# EAGLE design seed-raspi (EAGLE 6.4)

## Sheet 1 of 7

## Sheet 2 of 7
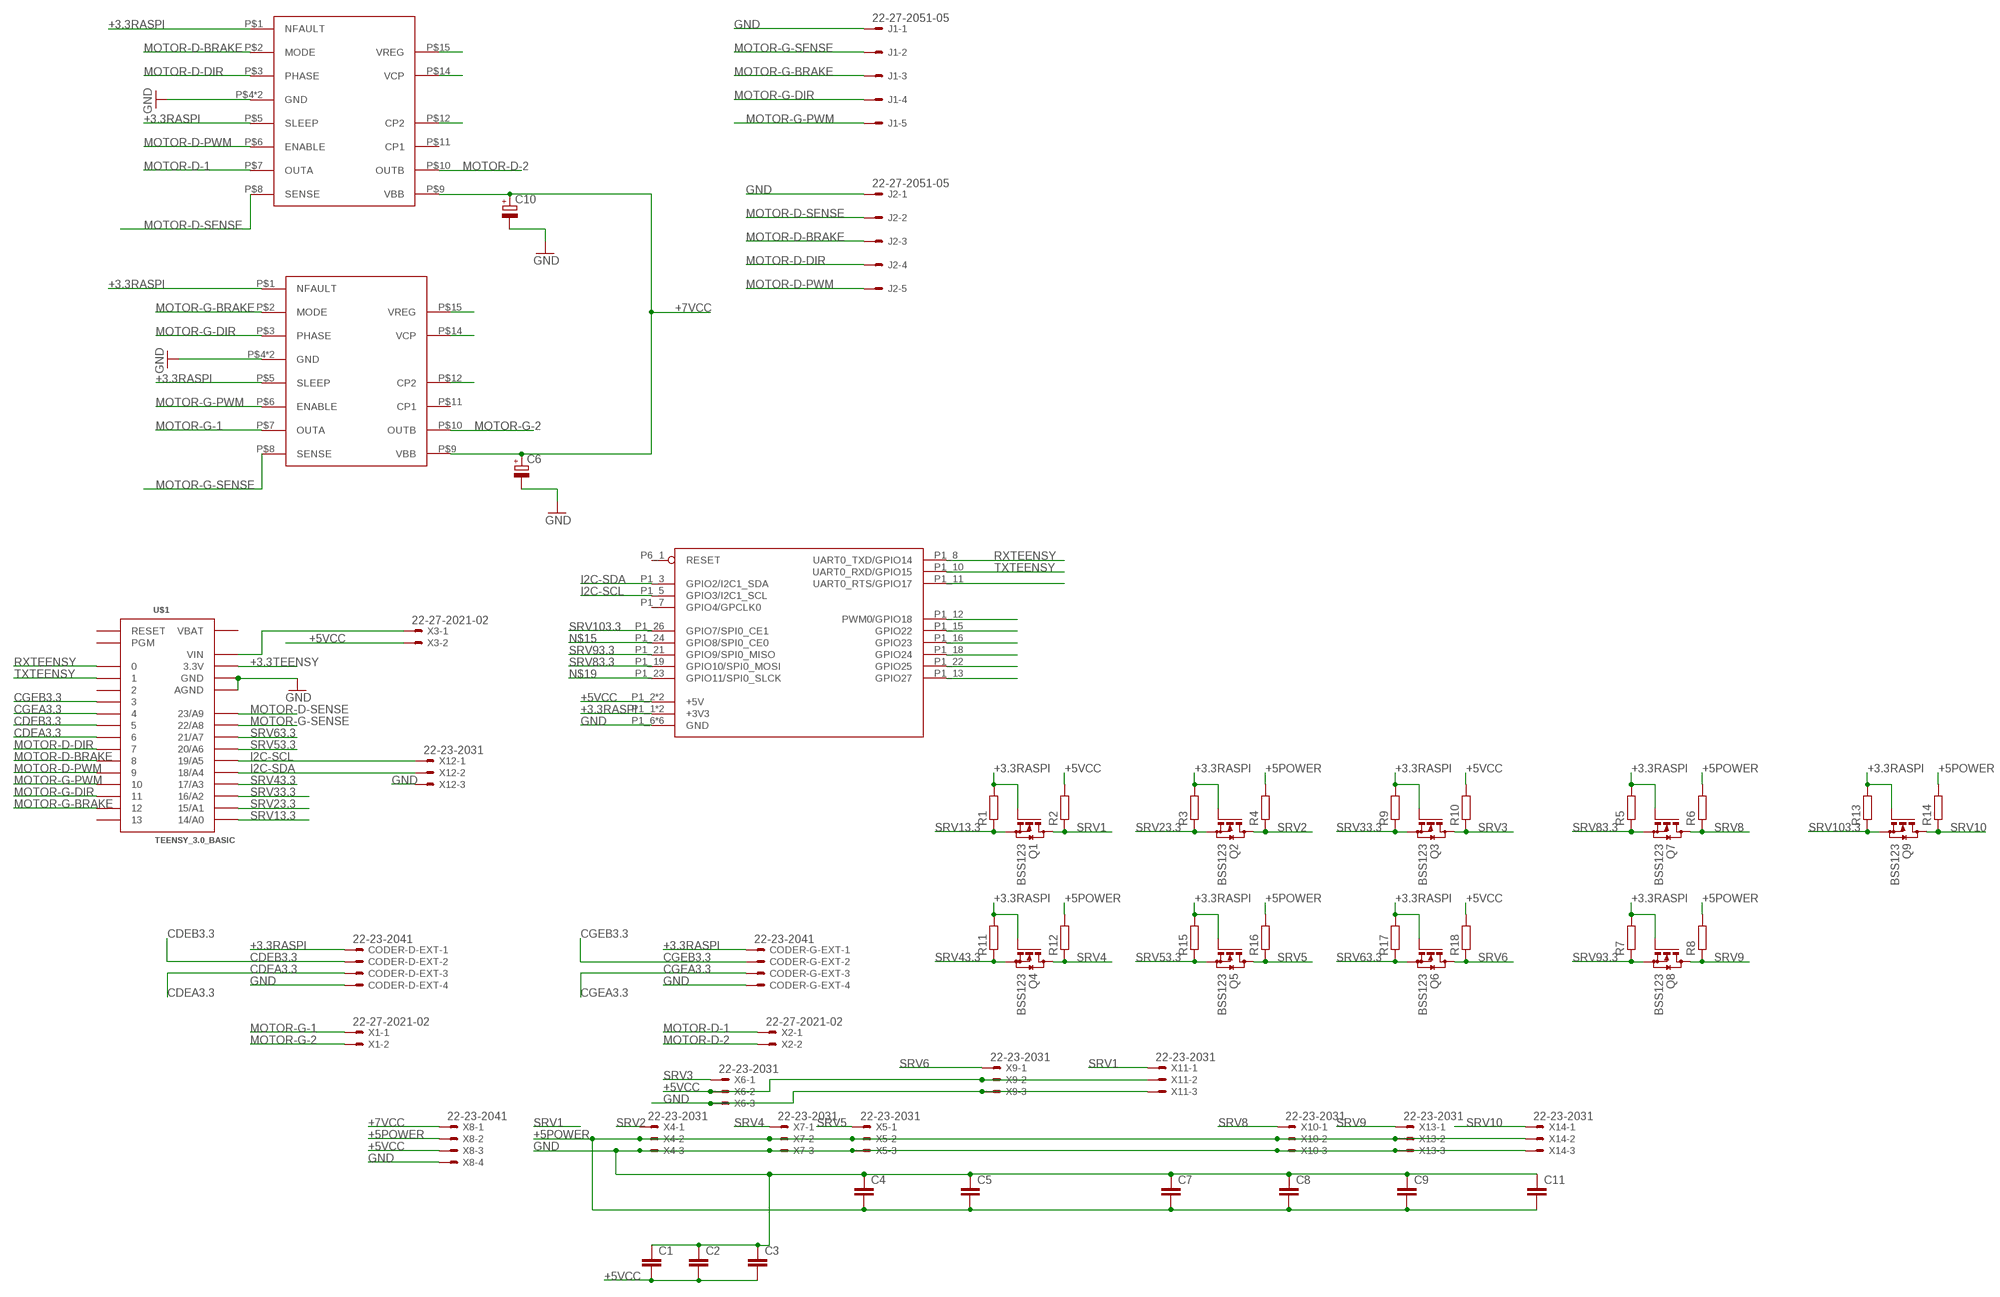
[diagram p0: schematic, sheet 2]

### Parts
C1  C-EUC0603K  [C0603K]
C2  C-EUC0603K  [C0603K]
C3  C-EUC0603K  [C0603K]
C4  C-EUC0603K  [C0603K]
C5  C-EUC0603K  [C0603K]
C6  CPOL-EUE3.5-8  [E3,5-8]
C7  C-EUC0603K  [C0603K]
C8  C-EUC0603K  [C0603K]
C9  C-EUC0603K  [C0603K]
C10  CPOL-EUE3.5-8  [E3,5-8]
C11  C-EUC0603K  [C0603K]
CODER-D-EXT  22-23-2041  [22-23-2041]
CODER-G-EXT  22-23-2041  [22-23-2041]
J1  22-27-2051-05  [6410-05]
J2  22-27-2051-05  [6410-05]
Q1  BSS123  [SOT23]
Q2  BSS123  [SOT23]
Q3  BSS123  [SOT23]
Q4  BSS123  [SOT23]
Q5  BSS123  [SOT23]
Q6  BSS123  [SOT23]
Q7  BSS123  [SOT23]
Q8  BSS123  [SOT23]
Q9  BSS123  [SOT23]
R1  R-EU_R0603  [R0603]
R2  R-EU_R0603  [R0603]
R3  R-EU_R0603  [R0603]
R4  R-EU_R0603  [R0603]
R5  R-EU_R0603  [R0603]
R6  R-EU_R0603  [R0603]
R7  R-EU_R0603  [R0603]
R8  R-EU_R0603  [R0603]
R9  R-EU_R0603  [R0603]
R10  R-EU_R0603  [R0603]
R11  R-EU_R0603  [R0603]
R12  R-EU_R0603  [R0603]
R13  R-EU_R0603  [R0603]
R14  R-EU_R0603  [R0603]
R15  R-EU_R0603  [R0603]
R16  R-EU_R0603  [R0603]
R17  R-EU_R0603  [R0603]
R18  R-EU_R0603  [R0603]
U$1  TEENSY_3.0_BASIC  [TEENSY_3.0_BASIC]
U$2  RPI-B-V2SHIELD  [RPI-B-V2-SHIELD]
U$3  A3950-DIL  [DIL16]
U$4  A3950-DIL  [DIL16]
X1  22-27-2021-02  [6410-02]
X2  22-27-2021-02  [6410-02]
X3  22-27-2021-02  [6410-02]
X4  22-23-2031  [22-23-2031]
X5  22-23-2031  [22-23-2031]
X6  22-23-2031  [22-23-2031]
X7  22-23-2031  [22-23-2031]
X8  22-23-2041  [22-23-2041]
X9  22-23-2031  [22-23-2031]
X10  22-23-2031  [22-23-2031]
X11  22-23-2031  [22-23-2031]
X12  22-23-2031  [22-23-2031]
X13  22-23-2031  [22-23-2031]
X14  22-23-2031  [22-23-2031]

### Nets
+3.3RASPI: CODER-D-EXT.1 CODER-G-EXT.1 Q1.1(G) Q2.1(G) Q3.1(G) Q4.1(G) Q5.1(G) Q6.1(G) Q7.1(G) Q8.1(G) Q9.1(G) R1.2 R3.2 R5.2 R7.2 R9.2 R11.2 R13.2 R15.2 R17.2 U$2.P1_1(+3V3) U$2.P1_17(+3V3) U$3.P$1(NFAULT) U$3.P$5(SLEEP) U$4.P$1(NFAULT) U$4.P$5(SLEEP)
+3.3TEENSY: U$1.3.3V U$1.3.3V1(3.3V)
+5POWER: C4.2 C5.2 C7.2 C8.2 C9.2 C11.2 R4.2 R6.2 R8.2 R12.2 R14.2 R16.2 X4.2 X5.2 X7.2 X8.2 X10.2 X13.2 X14.2
+5VCC: C1.2 C2.2 C3.2 R2.2 R10.2 R18.2 U$2.P1_2(+5V) U$2.P1_4(+5V) X3.2 X6.2 X8.3 X9.2 X11.2
+7VCC: C6.+ C10.+ U$3.P$9(VBB) U$4.P$9(VBB) X8.1
CDEA3.3: CODER-D-EXT.3 U$1.6
CDEB3.3: CODER-D-EXT.2 U$1.5
CGEA3.3: CODER-G-EXT.3 U$1.4
CGEB3.3: CODER-G-EXT.2 U$1.3
GND: C1.1 C2.1 C3.1 C4.1 C5.1 C6.- C7.1 C8.1 C9.1 C10.- C11.1 CODER-D-EXT.4 CODER-G-EXT.4 J1.1 J2.1 U$1.AGND U$1.GND U$1.GND1(GND) U$2.P1_6(GND) U$2.P1_9(GND) U$2.P1_14(GND) U$2.P1_20(GND) U$2.P1_25(GND) U$2.P6_2(GND) U$3.P$4(GND) U$3.P$13(GND) U$4.P$4(GND) U$4.P$13(GND) X4.3 X5.3 X6.3 X7.3 X8.4 X9.3 X10.3 X11.3 X12.3 X13.3 X14.3 ; also sheet 3,4,5,6,7
I2C-SCL: U$1.19/A5 U$2.P1_5(GPIO3/I2C1_SCL) X12.1
I2C-SDA: U$1.18/A4 U$2.P1_3(GPIO2/I2C1_SDA) X12.2
MOTOR-D-1: U$4.P$7(OUTA) X2.1
MOTOR-D-2: U$4.P$10(OUTB) X2.2
MOTOR-D-BRAKE: J2.3 U$1.8 U$4.P$2(MODE)
MOTOR-D-DIR: J2.4 U$1.7 U$4.P$3(PHASE)
MOTOR-D-PWM: J2.5 U$1.9 U$4.P$6(ENABLE)
MOTOR-D-SENSE: J2.2 U$1.23/A9 U$4.P$8(SENSE)
MOTOR-G-1: U$3.P$7(OUTA) X1.1
MOTOR-G-2: U$3.P$10(OUTB) X1.2
MOTOR-G-BRAKE: J1.3 U$1.12 U$3.P$2(MODE)
MOTOR-G-DIR: J1.4 U$1.11 U$3.P$3(PHASE)
MOTOR-G-PWM: J1.5 U$1.10 U$3.P$6(ENABLE)
MOTOR-G-SENSE: J1.2 U$1.22/A8 U$3.P$8(SENSE)
N$1: U$2.P1_12(PWM0/GPIO18)
N$2: U$2.P1_11(UART0_RTS/GPIO17)
N$3: U$1.VIN X3.1
N$4: U$2.P1_15(GPIO22)
N$5: U$2.P1_16(GPIO23)
N$6: U$2.P1_18(GPIO24)
N$7: U$2.P1_22(GPIO25)
N$8: U$3.P$15(VREG)
N$9: U$3.P$14(VCP)
N$10: U$3.P$12(CP2)
N$11: U$2.P1_13(GPIO27)
N$13: U$4.P$15(VREG)
N$14: U$4.P$14(VCP)
N$15: U$2.P1_24(GPIO8/SPI0_CE0)
N$16: U$4.P$12(CP2)
N$19: U$2.P1_23(GPIO11/SPI0_SLCK)
RXTEENSY: U$1.0 U$2.P1_8(UART0_TXD/GPIO14)
SRV1: Q1.3(D) R2.1 X11.1
SRV2: Q2.3(D) R4.1 X4.1
SRV3: Q3.3(D) R10.1 X6.1
SRV4: Q4.3(D) R12.1 X7.1
SRV5: Q5.3(D) R16.1 X5.1
SRV6: Q6.3(D) R18.1 X9.1
SRV8: Q7.3(D) R6.1 X10.1
SRV9: Q8.3(D) R8.1 X13.1
SRV10: Q9.3(D) R14.1 X14.1
SRV13.3: Q1.2(S) R1.1 U$1.14/A0
SRV23.3: Q2.2(S) R3.1 U$1.15/A1
SRV33.3: Q3.2(S) R9.1 U$1.16/A2
SRV43.3: Q4.2(S) R11.1 U$1.17/A3
SRV53.3: Q5.2(S) R15.1 U$1.20/A6
SRV63.3: Q6.2(S) R17.1 U$1.21/A7
SRV83.3: Q7.2(S) R5.1 U$2.P1_19(GPIO10/SPI0_MOSI)
SRV93.3: Q8.2(S) R7.1 U$2.P1_21(GPIO9/SPI0_MISO)
SRV103.3: Q9.2(S) R13.1 U$2.P1_26(GPIO7/SPI0_CE1)
TXTEENSY: U$1.1 U$2.P1_10(UART0_RXD/GPIO15)
Unconnected: U$1.2 U$1.13 U$1.PGM U$1.RESET U$2.P1_7(GPIO4/GPCLK0) U$3.P$11(CP1) U$4.P$11(CP1)

## Sheet 3 of 7
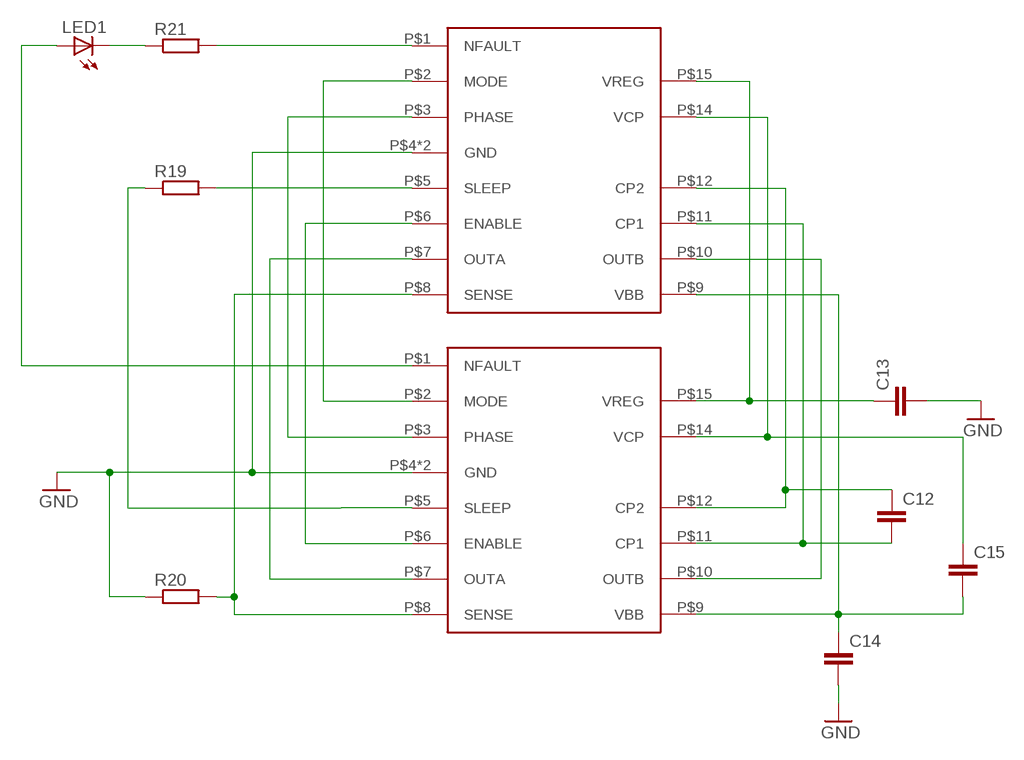
[diagram p1: schematic, sheet 3]

### Parts
C12  C-EUC0603  [C0603]
C13  C-EUC0603  [C0603]
C14  C-EUC0603  [C0603]
C15  C-EUC0603  [C0603]
LED1  LED3MM  [LED3MM]
R19  R-EU_R0603  [R0603]
R20  R-EU_R0603  [R0603]
R21  R-EU_R0603  [R0603]
U$5  A3950  [16TSSOP]
U$6  A3950-DIL  [DIL16]

### Nets
GND: C13.2 C14.2 R20.1 U$5.P$4(GND) U$5.P$13(GND) U$6.P$4(GND) U$6.P$13(GND) ; also sheet 2,4,5,6,7
N$12: R19.1 U$6.P$5(SLEEP)
N$17: LED1.A U$6.P$1(NFAULT)
N$18: U$5.P$2(MODE) U$6.P$2(MODE)
N$20: U$5.P$3(PHASE) U$6.P$3(PHASE)
N$21: U$5.P$6(ENABLE) U$6.P$6(ENABLE)
N$22: U$5.P$7(OUTA) U$6.P$7(OUTA)
N$23: R20.2 U$5.P$8(SENSE) U$6.P$8(SENSE)
N$24: C13.1 U$5.P$15(VREG) U$6.P$15(VREG)
N$25: C15.1 U$5.P$14(VCP) U$6.P$14(VCP)
N$26: C12.1 U$5.P$12(CP2) U$6.P$12(CP2)
N$27: C12.2 U$5.P$11(CP1) U$6.P$11(CP1)
N$28: U$5.P$10(OUTB) U$6.P$10(OUTB)
N$29: C14.1 C15.2 U$5.P$9(VBB) U$6.P$9(VBB)
N$30: R19.2 U$5.P$5(SLEEP)
N$31: R21.2 U$5.P$1(NFAULT)
N$32: LED1.K(C) R21.1

## Sheet 4 of 7
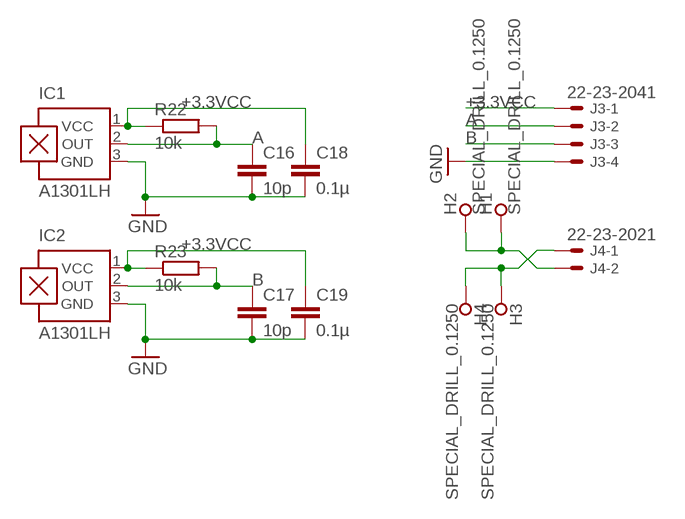
[diagram p2: schematic, sheet 4]

### Parts
C16  10p  C-EUC0805  [C0805]
C17  10p  C-EUC0805  [C0805]
C18  0.1µ  C-EUC0805  [C0805]
C19  0.1µ  C-EUC0805  [C0805]
H1  SPECIAL_DRILL_0.1250  [PAD_0.1250]
H2  SPECIAL_DRILL_0.1250  [PAD_0.1250]
H3  SPECIAL_DRILL_0.1250  [PAD_0.1250]
H4  SPECIAL_DRILL_0.1250  [PAD_0.1250]
IC1  A1301LH  [SOT23-W]
IC2  A1301LH  [SOT23-W]
J3  22-23-2041  [22-23-2041]
J4  22-23-2021  [22-23-2021]
R22  10k  R-EU_R0805  [R0805]
R23  10k  R-EU_R0805  [R0805]

### Nets
+3.3VCC: C18.1 C19.1 IC1.1(VCC) IC2.1(VCC) J3.1 R22.1 R23.1 ; also sheet 6,7
A: C16.1 IC1.2(OUT) J3.2 R22.2 ; also sheet 6,7
B: C17.1 IC2.2(OUT) J3.3 R23.2 ; also sheet 6,7
GND: C16.2 C17.2 C18.2 C19.2 IC1.3(GND) IC2.3(GND) J3.4 ; also sheet 2,3,5,6,7
N$36: H1.1 H2.1 J4.2
N$37: H3.1 H4.1 J4.1

## Sheet 5 of 7
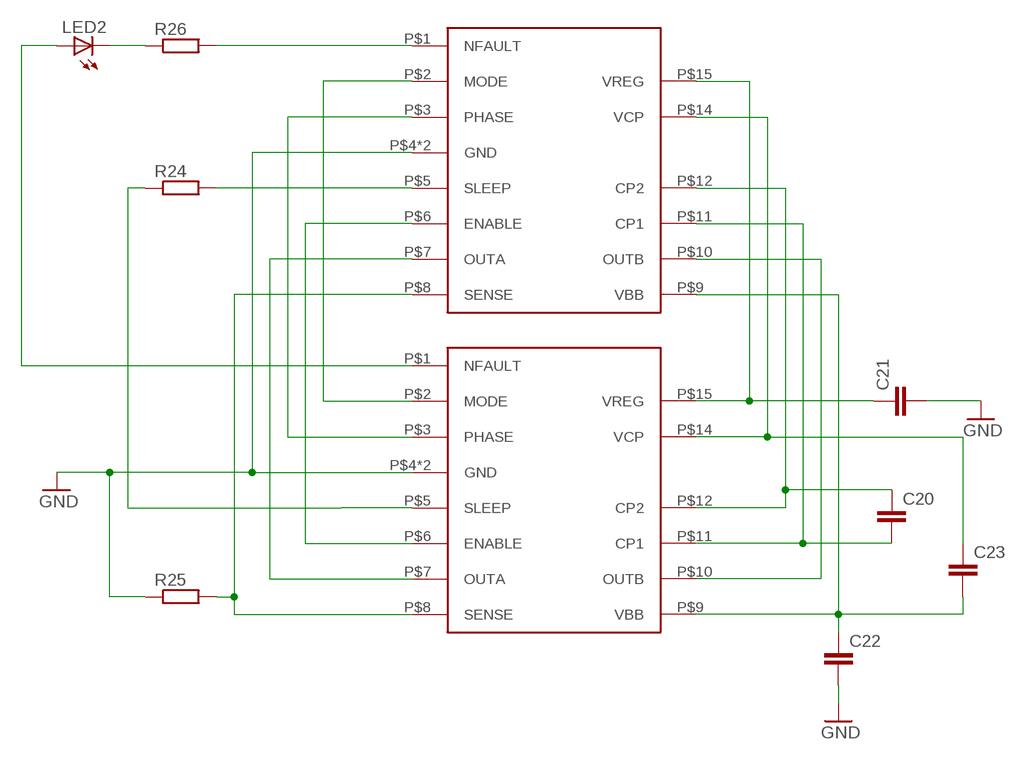
[diagram p3: schematic, sheet 5]

### Parts
C20  C-EUC0603  [C0603]
C21  C-EUC0603  [C0603]
C22  C-EUC0603  [C0603]
C23  C-EUC0603  [C0603]
LED2  LED3MM  [LED3MM]
R24  R-EU_R0603  [R0603]
R25  R-EU_R0603  [R0603]
R26  R-EU_R0603  [R0603]
U$7  A3950  [16TSSOP]
U$8  A3950-DIL  [DIL16]

### Nets
GND: C21.2 C22.2 R25.1 U$7.P$4(GND) U$7.P$13(GND) U$8.P$4(GND) U$8.P$13(GND) ; also sheet 2,3,4,6,7
N$41: R24.1 U$8.P$5(SLEEP)
N$42: LED2.A U$8.P$1(NFAULT)
N$43: U$7.P$2(MODE) U$8.P$2(MODE)
N$44: U$7.P$3(PHASE) U$8.P$3(PHASE)
N$45: U$7.P$6(ENABLE) U$8.P$6(ENABLE)
N$46: U$7.P$7(OUTA) U$8.P$7(OUTA)
N$47: R25.2 U$7.P$8(SENSE) U$8.P$8(SENSE)
N$48: C21.1 U$7.P$15(VREG) U$8.P$15(VREG)
N$49: C23.1 U$7.P$14(VCP) U$8.P$14(VCP)
N$50: C20.1 U$7.P$12(CP2) U$8.P$12(CP2)
N$51: C20.2 U$7.P$11(CP1) U$8.P$11(CP1)
N$52: U$7.P$10(OUTB) U$8.P$10(OUTB)
N$53: C22.1 C23.2 U$7.P$9(VBB) U$8.P$9(VBB)
N$54: R24.2 U$7.P$5(SLEEP)
N$55: R26.2 U$7.P$1(NFAULT)
N$56: LED2.K(C) R26.1

## Sheet 6 of 7
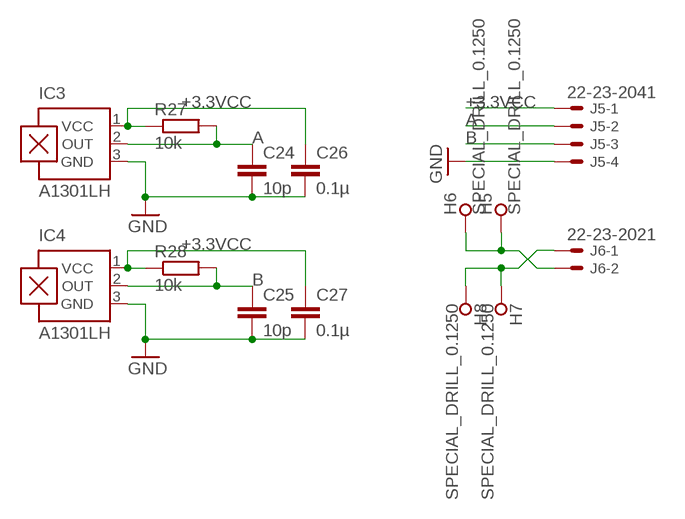
[diagram p4: schematic, sheet 6]

### Parts
C24  10p  C-EUC0805  [C0805]
C25  10p  C-EUC0805  [C0805]
C26  0.1µ  C-EUC0805  [C0805]
C27  0.1µ  C-EUC0805  [C0805]
H5  SPECIAL_DRILL_0.1250  [PAD_0.1250]
H6  SPECIAL_DRILL_0.1250  [PAD_0.1250]
H7  SPECIAL_DRILL_0.1250  [PAD_0.1250]
H8  SPECIAL_DRILL_0.1250  [PAD_0.1250]
IC3  A1301LH  [SOT23-W]
IC4  A1301LH  [SOT23-W]
J5  22-23-2041  [22-23-2041]
J6  22-23-2021  [22-23-2021]
R27  10k  R-EU_R0805  [R0805]
R28  10k  R-EU_R0805  [R0805]

### Nets
+3.3VCC: C26.1 C27.1 IC3.1(VCC) IC4.1(VCC) J5.1 R27.1 R28.1 ; also sheet 4,7
A: C24.1 IC3.2(OUT) J5.2 R27.2 ; also sheet 4,7
B: C25.1 IC4.2(OUT) J5.3 R28.2 ; also sheet 4,7
GND: C24.2 C25.2 C26.2 C27.2 IC3.3(GND) IC4.3(GND) J5.4 ; also sheet 2,3,4,5,7
N$60: H5.1 H6.1 J6.2
N$61: H7.1 H8.1 J6.1

## Sheet 7 of 7
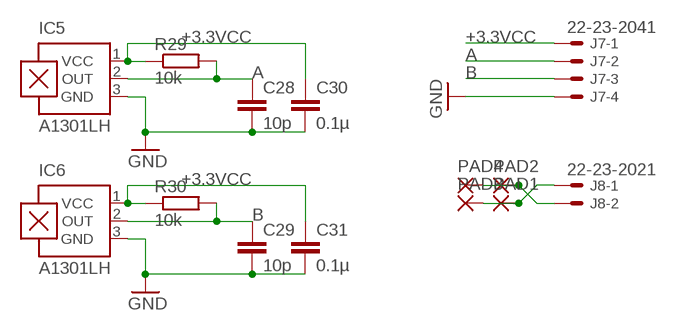
[diagram p5: schematic, sheet 7]

### Parts
C28  10p  C-EUC0805  [C0805]
C29  10p  C-EUC0805  [C0805]
C30  0.1µ  C-EUC0805  [C0805]
C31  0.1µ  C-EUC0805  [C0805]
IC5  A1301LH  [SOT23-W]
IC6  A1301LH  [SOT23-W]
J7  22-23-2041  [22-23-2041]
J8  22-23-2021  [22-23-2021]
PAD1  3,81/1,4  [3,81/1,4]
PAD2  3,81/1,4  [3,81/1,4]
PAD3  3,81/1,4  [3,81/1,4]
PAD4  3,81/1,4  [3,81/1,4]
R29  10k  R-EU_R0805  [R0805]
R30  10k  R-EU_R0805  [R0805]

### Nets
+3.3VCC: C30.1 C31.1 IC5.1(VCC) IC6.1(VCC) J7.1 R29.1 R30.1 ; also sheet 4,6
A: C28.1 IC5.2(OUT) J7.2 R29.2 ; also sheet 4,6
B: C29.1 IC6.2(OUT) J7.3 R30.2 ; also sheet 4,6
GND: C28.2 C29.2 C30.2 C31.2 IC5.3(GND) IC6.3(GND) J7.4 ; also sheet 2,3,4,5,6
N$65: J8.2 PAD2.1(P) PAD4.1(P)
N$66: J8.1 PAD1.1(P) PAD3.1(P)

## Power pins joined to a net without a drawn wire
RESET: U$2.P6_1(RESET)
VBAT: U$1.VBAT

## Library data of the parts
C1-C5 C7-C9 C11-C31 = rcl:C-EU: CAPACITOR, European symbol
C6 C10 = rcl:CPOL-EU: POLARIZED CAPACITOR, European symbol
CODER-D-EXT CODER-G-EXT J3 J5 J7 X8 = con-molex:22-23-2041: .100" (2.54mm) Center Header - 4 Pin; MF: MOLEX; MPN: 22-23-2041; OC_FARNELL: 1462920; OC_NEWARK: 38C0355
H1-H8 = special-drill:SPECIAL_DRILL_: Special drills
IC1-IC6 = allegro:A13*?: Linear Hall Effect Sensor ICs Continuous-Time Ratiometric High-Temperature Operation Programmable Linear with Analog Output A1302 -Replacement- UGN3503 Source: http://www.allegromicro.com/en/Products/Part_Numbers/1301/1301.pdf http://www.allegromicro.com/en/Products/Part_Numbers/1321/1321.pdf http://www.allegromicro.com/en/Products/Part_Numbers/1381/1381.pdf; MF: ALLEGRO MICROSYSTEMS, INC.; MPN: A1301ELHLT-T; OC_FARNELL: 1198084; OC_NEWARK: 31K6634
J1 J2 = con-molex:22-?-05: CONNECTOR wire to board 2.54 mm (.1 inch) pitch header; OC_FARNELL: unknown; OC_NEWARK: unknown
J4 J6 J8 = con-molex:22-23-2021: .100" (2.54mm) Center Header - 2 Pin; MF: MOLEX; MPN: 22-23-2021; OC_FARNELL: 1462926; OC_NEWARK: 25C3832
LED1 LED2 = led:LED: LED OSRAM: - CHIPLED LG R971, LG N971, LY N971, LG Q971, LY Q971, LO R971, LY R971 LH N974, LH R974 LS Q976, LO Q976, LY Q976 LO Q996 - Hyper CHIPLED LW Q18S LB Q993, LB Q99A, LB R99A - SideLED LS A670, LO A670, LY A670, LG A670, LP A670 LB A673, LV A673, LT A673, LW A673 LH A674 LY A675 LS A676, LA A676, LO A676, LY A676, LW A676 LS A679, LY A679, LG A679 - Hyper Micro SIDELED® LS Y876, LA Y876, LO Y876, LY Y876 LT Y87S - SmartLED LW L88C, LW L88S LB L89C, LB L89S, LG L890 LS L89K, LO L89K, LY L89K LS L896, LA L896, LO L896, LY L896 - TOPLED LS T670, LO T670, LY T670, LG T670, LP T670 LSG T670, LSP T670, LSY T670, LOP T670, LYG T670 LG T671, LOG T671, LSG T671 LB T673, LV T673, LT T673, LW T673 LH T674 LS T676, LA T676, LO T676, LY T676, LB T676, LH T676, LSB T676, LW T676 LB T67C, LV T67C, LT T67C, LS T67K, LO T67K, LY T67K, LW E67C LS E67B, LA E67B, LO E67B, LY E67B, LB E67C, LV E67C, LT E67C LW T67C LS T679, LY T679, LG T679 LS T770, LO T770, LY T770, LG T770, LP T770 LB T773, LV T773, LT T773, LW T773 LH T774 LS E675, LA E675, LY E675, LS T675 LS T776, LA T776, LO T776, LY T776, LB T776 LHGB T686 LT T68C, LB T68C - Hyper Mini TOPLED® LB M676 - Mini TOPLED Santana® LG M470 LS M47K, LO M47K, LY M47K Source: http://www.osram.convergy.de LUXEON: - LUMILED® LXK2-PW12-R00, LXK2-PW12-S00, LXK2-PW14-U00, LXK2-PW14-V00 LXK2-PM12-R00, LXK2-PM12-S00, LXK2-PM14-U00 LXK2-PE12-Q00, LXK2-PE12-R00, LXK2-PE12-S00, LXK2-PE14-T00, LXK2-PE14-U00 LXK2-PB12-K00, LXK2-PB12-L00, LXK2-PB12-M00, LXK2-PB14-N00, LXK2-PB14-P00, LXK2-PB14-Q00 LXK2-PR12-L00, LXK2-PR12-M00, LXK2-PR14-Q00, LXK2-PR14-R00 LXK2-PD12-Q00, LXK2-PD12-R00, LXK2-PD12-S00 LXK2-PH12-R00, LXK2-PH12-S00 LXK2-PL12-P00, LXK2-PL12-Q00, LXK2-PL12-R00 Source: www.luxeon.com KINGBRIGHT: KA-3528ASYC Source: www.kingbright.com
PAD1-PAD4 = wirepad:3,81/1,4: THROUGH-HOLE PAD
Q1-Q9 = transistor-small-signal:BSS123: N-CHANNEL MOS FET
R1-R30 = rcl:R-EU_: RESISTOR, European symbol
U$1 = Teensy3.0:TEENSY_3.0_BASIC: Basic Teensy 3.0 with none of the 'inner' pins enabled. See '+4', 'AllAnalogPins", and 'AllPins' packages for additional pin holes, as needed.
U$2 = raspberry:RPI-B-V2: Second revision of the Model 2 board including the P5 and P6 headers. Mounting holes have been added. Choose the "SHIELD" variant for a predefined Dimension layer and drilling holes. Theres also a "SHIELD" variant for the Model A without a RJ45 connector.
U$3 U$4 U$6 U$8 = A3950:A3950-DIL
U$5 U$7 = A3950:A3950
X1-X3 = con-molex:22-?-02: CONNECTOR wire to board 2.54 mm (.1 inch) pitch header; OC_FARNELL: unknown; OC_NEWARK: unknown
X4-X7 X9-X14 = con-molex:22-23-2031: .100" (2.54mm) Center Header - 3 Pin; MF: MOLEX; MPN: 22-23-2031; OC_FARNELL: 1462950; OC_NEWARK: 30C0862

## Net classes
0 default: clearance 0.355 mm

## Board
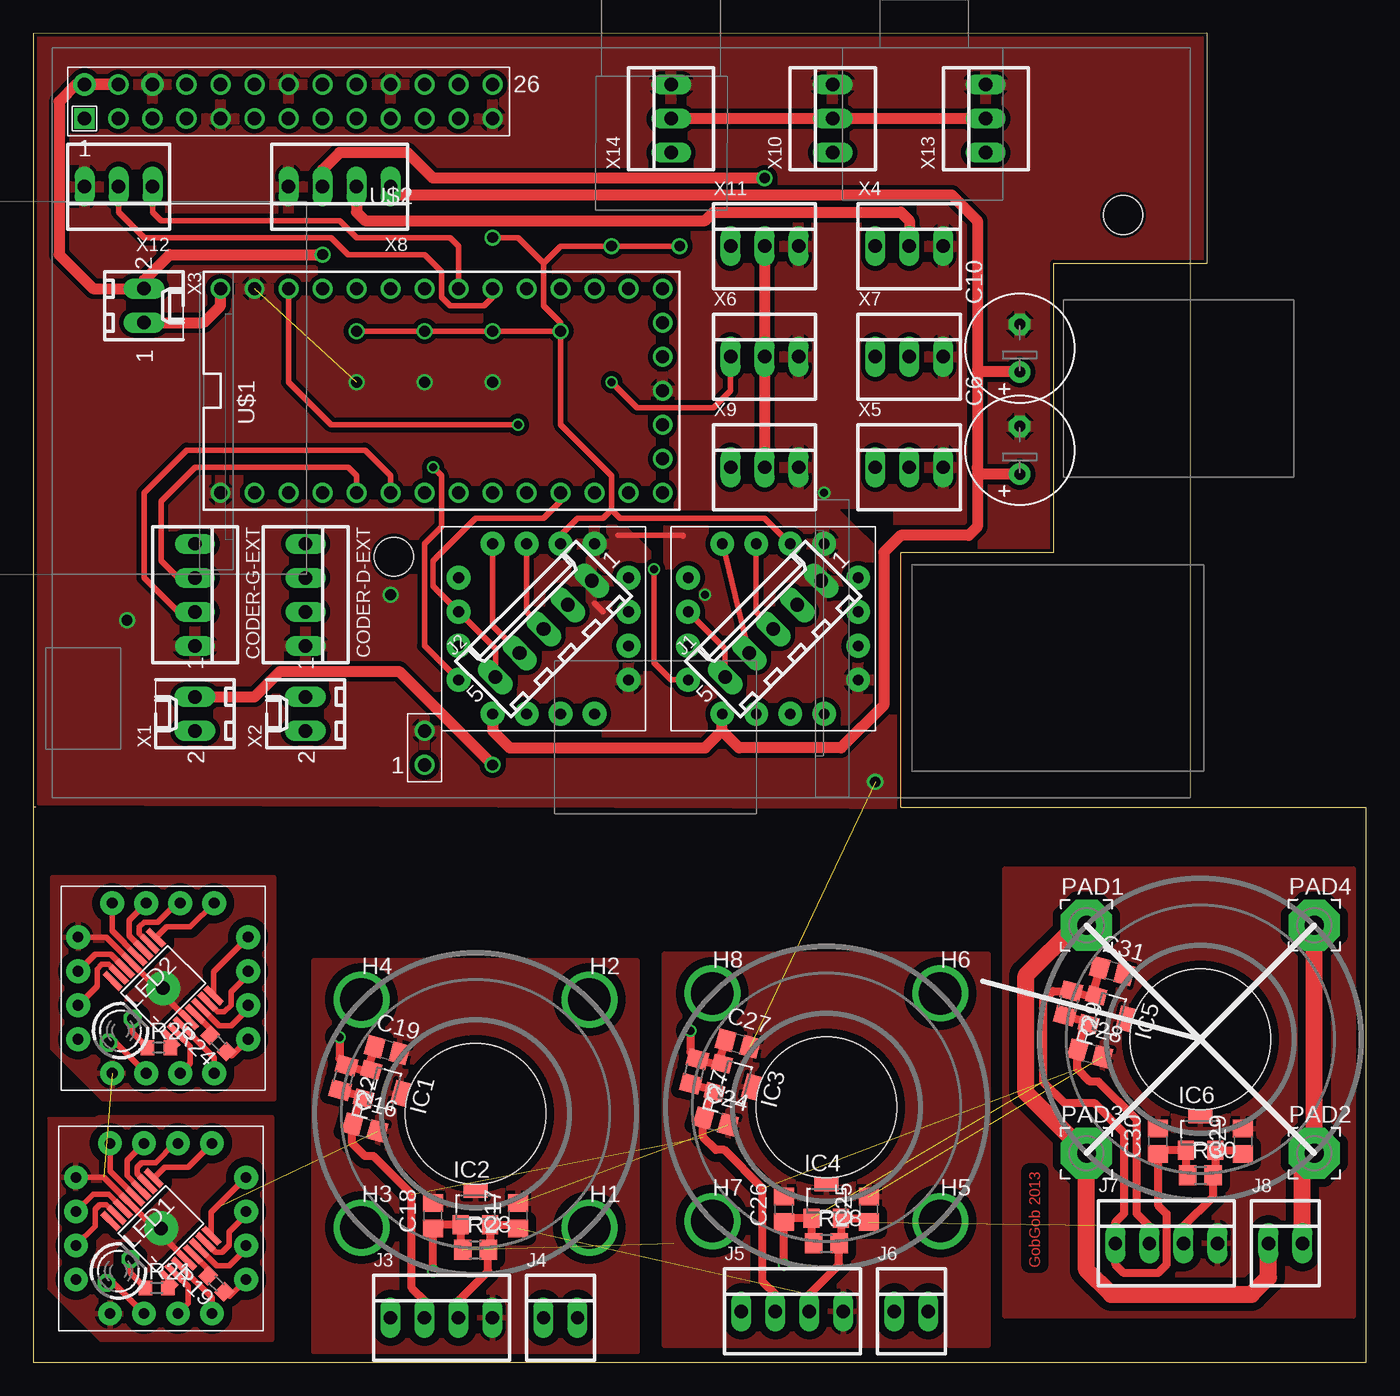
[diagram p6: board, top side]
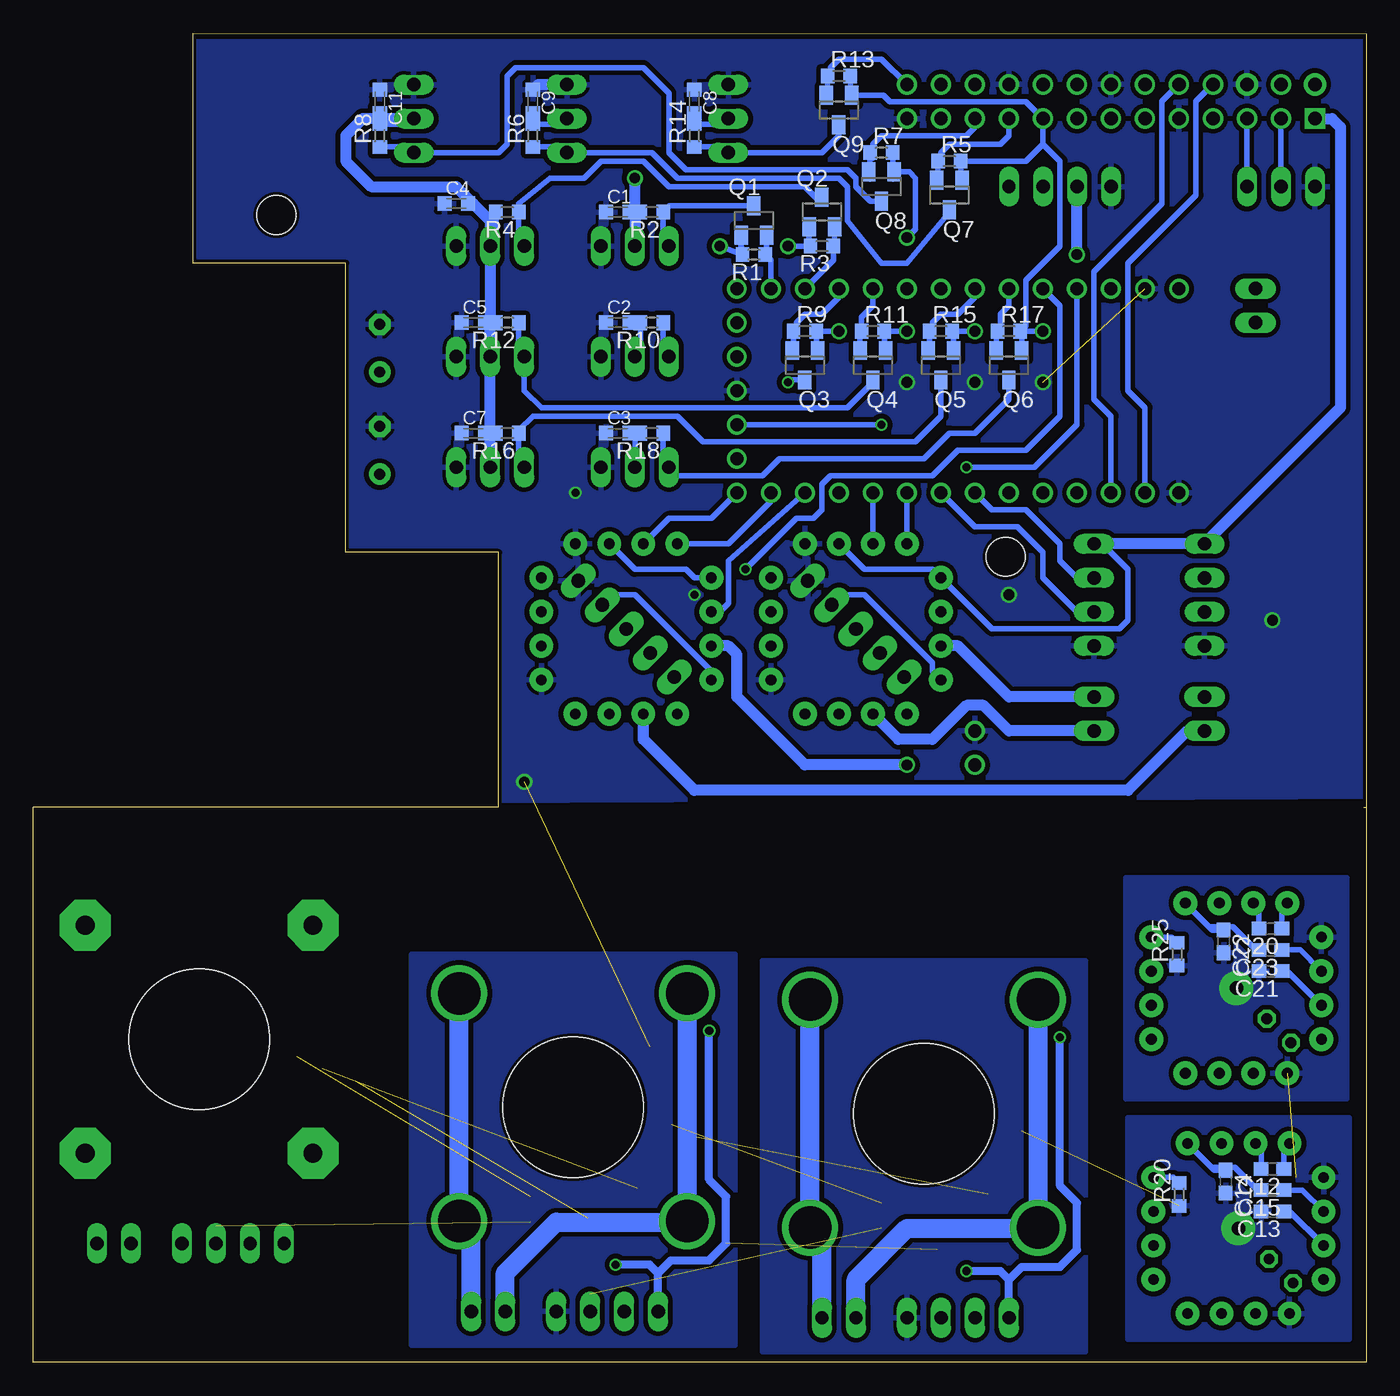
[diagram p7: board, bottom side, seen from below]

Size 99.52 x 99.22 mm. Coordinates in mm from the lower left corner, seen from the top.
Outline: 0,41.43 0,99.21 87.63,99.22 87.63,82.07 76.2,82.07 76.2,60.48 64.77,60.48 64.77,41.43
Outline: 64.77,41.43 64.77,41.43
Outline: 64.77,41.43 99.52,41.43 99.52,0 0,0 0,41.43 0.16,41.43
Copper layers (1*16): Top 0.035mm / dielectric 1.5mm / Bottom 0.035mm
Design rules "SeeedStudio_DRU_no_angle_2layer": minimum track width 6mil, minimum drill 12mil, track to track 6mil, track to pad 6mil, pad to pad 6mil, via to via 6mil, smd to smd 0mil, copper to edge 10mil, drill to drill 10mil, minimum pad ring 10mil, minimum via ring 6mil, stop-mask expansion 2mil, vias tented up to drill 25mil, thermal gap 10mil
Holes 10.5 mm at 33.01,18.57 59.21,19.05 87.15,24.13

### Footprints (pad centres in the part's own frame; a part is rotated, then mirrored left to right if it is on the bottom)
C0603K = smd 1.05 x 1.08: 1 -0.875,0; 2 0.875,0
E3,5-8 = drill 0.813 pad 1.6: + -1.778,0 | drill 0.813 pad 1.6 octagon: - 1.778,0
C0603 = smd 1.1 x 1: 1 -0.85,0; 2 0.85,0
C0805 = smd 1.3 x 1.5: 1 -0.95,0; 2 0.95,0
22-23-2041 = drill 1 long: 1 -3.81,0; 2 -1.27,0; 3 1.27,0; 4 3.81,0
PAD_0.1250 = drill 3.175 pad 3.175: 1 0,0
SOT23-W = smd 1.2 x 1.4: 1 -1.1,-1.3; 2 1.1,-1.3 | smd 1.8 x 1.2: 3 0,1.3
6410-05 = drill 1.016 long: 1 5.08,0; 2 2.54,0; 3 0,0; 4 -2.54,0; 5 -5.08,0
22-23-2021 = drill 1 long: 1 -1.27,0; 2 1.27,0
LED3MM = drill 0.813 octagon: A -1.27,0; K 1.27,0
3,81/1,4 = drill 1.397 pad 3.81 octagon: 1 0,0
SOT23 = smd 1 x 1.4: 1 -0.95,-1.1; 2 0.95,-1.1; 3 0,1.1
R0603 = smd 1 x 1.1: 1 -0.85,0; 2 0.85,0
R0805 = smd 1.3 x 1.5: 1 -0.95,0; 2 0.95,0
TEENSY_3.0_BASIC = drill 0.965: 0 -7.62,13.97; 1 -7.62,11.43; 2 -7.62,8.89; 3 -7.62,6.35; 3.3V 7.62,11.43; 3.3V1 -2.54,-16.51; 4 -7.62,3.81; 5 -7.62,1.27; 6 -7.62,-1.27; 7 -7.62,-3.81; 8 -7.62,-6.35; 9 -7.62,-8.89; 10 -7.62,-11.43; 11 -7.62,-13.97; 12 -7.62,-16.51; 13 7.62,-16.51; 14/A0 7.62,-13.97; 15/A1 7.62,-11.43; 16/A2 7.62,-8.89; 17/A3 7.62,-6.35; 18/A4 7.62,-3.81; 19/A5 7.62,-1.27; 20/A6 7.62,1.27; 21/A7 7.62,3.81; 22/A8 7.62,6.35; 23/A9 7.62,8.89; AGND 7.62,13.97; GND -7.62,16.51; GND1 0,-16.51; PGM 2.54,-16.51; RESET 5.08,-16.51; VBAT -5.08,-16.51; VIN 7.62,16.51
RPI-B-V2-SHIELD = drill 1 square: P1_1 0,0 | drill 1 pad 1.676: P1_2 0,2.54; P1_6 5.08,2.54 | drill 1: P1_3 2.54,0; P1_4 2.54,2.54; P1_5 5.08,0; P1_7 7.62,0; P1_8 7.62,2.54; P1_9 10.16,0; P1_10 10.16,2.54; P1_11 12.7,0; P1_12 12.7,2.54; P1_13 15.24,0; P1_14 15.24,2.54; P1_15 17.78,0; P1_16 17.78,2.54; P1_17 20.32,0; P1_18 20.32,2.54; P1_19 22.86,0; P1_20 22.86,2.54; P1_21 25.4,0; P1_22 25.4,2.54; P1_23 27.94,0; P1_24 27.94,2.54; P1_25 30.48,0; P1_26 30.48,2.54; P6_1 25.4,-48.26; P6_2 25.4,-45.72 | hole 2.9: 23.1,-32.72; 77.57,-7.21
DIL16 = drill 0.8 pad 1.778: P$1 -1.27,-6.35; P$2 1.27,-6.35; P$3 3.81,-6.35; P$4 -3.81,-6.35; P$5 6.35,-3.81; P$6 6.35,-1.27; P$7 6.35,1.27; P$8 6.35,3.81; P$9 3.81,6.35; P$10 1.27,6.35; P$11 -1.27,6.35; P$12 -3.81,6.35; P$13 -6.35,3.81; P$14 -6.35,1.27; P$15 -6.35,-1.27; P$16 -6.35,-3.81
16TSSOP = smd 0.45 x 1.7: P$1 -2.275,-3.05; P$2 -1.625,-3.05; P$3 -0.975,-3.05; P$4 -0.325,-3.05; P$5 0.325,-3.05; P$6 0.975,-3.05; P$7 1.625,-3.05; P$8 2.275,-3.05; P$9 2.275,3.05; P$10 1.625,3.05; P$11 0.975,3.05; P$12 0.325,3.05; P$13 -0.325,3.05; P$14 -0.975,3.05; P$15 -1.625,3.05; P$16 -2.275,3.05
6410-02 = drill 1.016 long: 1 1.27,0; 2 -1.27,0
22-23-2031 = drill 1 long: 1 -2.54,0; 2 0,0; 3 2.54,0

### Placement (x,y rotation side)
C1  55.88,85.88 0 bottom
C2  55.88,77.63 0 bottom
C3  55.88,69.37 0 bottom
C4  67.95,86.52 0 bottom
C5  66.68,77.63 0 bottom
C6  73.66,68.1 90 top
C7  66.68,69.37 0 bottom
C8  50.16,94.14 270 bottom
C9  62.23,94.14 270 bottom
C10  73.66,75.72 90 top
C11  73.66,94.14 270 bottom
C12  6.98,14.45 180 bottom
C13  6.98,11.27 180 bottom
C14  10.48,13.49 270 bottom
C15  6.98,12.86 180 bottom
C16  24.77,17.52 345 top
C17  36.19,10.95 90 top
C18  29.84,10.95 90 top
C19  26.41,23.34 345 top
C20  7.14,32.38 180 bottom
C21  7.14,29.21 180 bottom
C22  10.64,31.43 270 bottom
C23  7.14,30.8 180 bottom
C24  50.97,18 345 top
C25  62.39,11.43 90 top
C26  56.04,11.43 90 top
C27  52.61,23.82 345 top
C28  78.91,23.08 345 top
C29  90.33,16.51 90 top
C30  83.98,16.51 90 top
C31  80.55,29.21 345 top
CODER-D-EXT  20.32,57.31 270 top
CODER-G-EXT  12.06,57.31 270 top
H1  41.52,10.06 0 top
H2  41.52,27.08 0 top
H3  24.5,10.06 0 top
H4  24.5,27.08 0 top
H5  67.72,10.54 0 top
H6  67.72,27.56 0 top
H7  50.7,10.54 0 top
H8  50.7,27.56 0 top
IC1  26.2,20.42 255 top
IC2  33.01,11.59 0 top
IC3  52.4,20.9 255 top
IC4  59.21,12.06 0 top
IC5  80.34,25.98 255 top
IC6  87.15,17.14 0 top
J1  55.24,54.77 45 top
J2  38.1,54.77 45 top
J3  30.47,3.33 0 top
J4  39.36,3.33 0 top
J5  56.67,3.81 0 top
J6  65.56,3.81 0 top
J7  84.61,8.89 0 top
J8  93.5,8.89 0 top
LED1  6.35,6.83 45 top
LED2  6.51,24.77 45 top
PAD1  78.65,32.63 0 top
PAD2  95.66,15.62 0 top
PAD3  78.64,15.62 0 top
PAD4  95.66,32.64 0 top
Q1  45.72,85.25 0 bottom
Q2  40.64,85.88 0 bottom
Q3  41.91,74.45 180 bottom
Q4  36.83,74.45 180 bottom
Q5  31.75,74.45 180 bottom
Q6  26.67,74.45 180 bottom
Q7  31.11,87.15 180 bottom
Q8  36.2,87.79 180 bottom
Q9  39.37,93.5 180 bottom
R1  45.72,82.71 180 bottom
R2  53.34,85.88 180 bottom
R3  40.64,83.34 180 bottom
R4  64.14,85.88 180 bottom
R5  31.11,89.69 0 bottom
R6  62.23,91.6 90 bottom
R7  36.2,90.33 0 bottom
R8  73.66,91.6 90 bottom
R9  41.91,76.99 0 bottom
R10  53.34,77.63 180 bottom
R11  36.83,76.99 0 bottom
R12  64.14,77.63 180 bottom
R13  39.37,96.04 0 bottom
R14  50.16,91.6 90 bottom
R15  31.75,76.99 0 bottom
R16  64.14,69.37 180 bottom
R17  26.67,76.99 0 bottom
R18  53.34,69.37 180 bottom
R19  13.65,5.87 135 top
R20  13.97,12.54 90 bottom
R21  9.21,5.55 0 top
R22  23.14,21.24 255 top
R23  33.01,8.41 0 top
R24  13.81,23.81 135 top
R25  14.13,30.48 90 bottom
R26  9.37,23.5 0 top
R27  49.34,21.72 255 top
R28  59.21,8.89 0 top
R29  77.28,26.8 255 top
R30  87.15,13.97 0 top
U$1  30.48,72.55 90 top
U$2  3.81,92.87 0 top
U$3  55.24,54.77 180 top
U$4  38.1,54.77 180 top
U$5  9.52,10 45 top
U$6  9.52,10 0 top
U$7  9.68,27.94 45 top
U$8  9.68,27.94 0 top
X1  12.07,48.42 90 top
X2  20.32,48.42 90 top
X3  8.25,78.9 270 top
X4  65.41,83.34 0 top
X5  65.41,66.83 0 top
X6  54.61,75.09 0 top
X7  65.41,75.09 0 top
X8  22.86,87.79 180 top
X9  54.61,66.83 0 top
X10  59.69,92.87 90 top
X11  54.61,83.34 0 top
X12  6.35,87.79 180 top
X13  71.12,92.87 90 top
X14  47.62,92.87 90 top

### Tracks (layer width: path | path; a pad name or v marks a point on that pad's centre or on a via)
+3.3RASPI  (via drill 0.8)
  Top 0.406: v24.13,76.99 v29.21,76.99 v34.29,76.99 v39.37,76.99 | v48.26,83.34 v43.18,83.34 39.37,83.34 38.1,82.07 | v39.37,76.99 39.37,77.63 38.1,78.9 38.1,82.07 | 43.18,63.66 43.18,66.2 39.37,70.01 v39.37,76.99 | 43.18,63.66 42.54,63.02 40.64,63.02 39.37,61.75 U$4.P$1 | 43.18,63.66 43.81,63.02 54.61,63.02 U$3.P$1 | v34.29,83.98 36.19,83.98 38.1,82.07
  Bottom 0.406: 24.13,90.96 U$2.P1_17 25.4,94.14 35.56,94.14 36.02,94.6 Q9.1 38.52,94.7 R13.2 | 24.13,90.96 22.86,89.69 22.86,83.34 25.4,80.8 25.4,77.41 R17.2 | Q5.1 30.8,76.89 R15.2 v29.21,76.99 | Q6.1 25.72,76.89 R17.2 | R17.2 v24.13,76.99 | v34.29,76.99 R11.2 35.98,75.65 Q4.1 | Q3.1 41.06,75.65 R9.2 v39.37,76.99 | Q1.1 46.67,83.44 R1.2 v48.26,83.34 | Q2.1 41.59,83.44 R3.2 v43.18,83.34 | 19.68,61.12 17.78,59.21 17.78,55.4 18.41,54.77 27.94,54.77 U$4.P$5 32.38,59.21 37.46,59.21 U$4.P$1 | U$3.P$5 50.16,58.58 50.8,59.21 54.61,59.21 U$3.P$1 | Q7.1 30.26,88.35 R5.2 25.4,89.69 24.13,90.96 | R7.2 35.34,88.35 Q8.1 34.12,88.89 33.65,88.42 33.65,84.61 v34.29,83.98
  Bottom 0.813: U$2.P1_1 2.54,92.87 1.9,92.23 1.9,71.28 CODER-G-EXT.1 19.68,61.12 CODER-D-EXT.1
+3.3TEENSY  (via drill 0.6)
  Top 0.406: U$1.3.3V 19.05,73.18 22.22,70.01 v36.19,70.01
  Bottom 0.406: v36.19,70.01 U$1.3.3V1
+3.3VCC  (via drill 0.6)  (2 unrouted)
  Top 0.61: R23.1 31.91,8.56 IC2.1 30.12,10.29 C18.1 v29.84,6.82 | C19.1 25.03,22.17 IC1.1 25.05,21.71 | 25.05,21.71 R22.1 22.85,22.69 v22.85,24.29 | 25.05,21.71 25.05,22.41 | R28.1 58.11,9.04 IC4.1 56.32,10.77 C26.1 v56.04,7.3 | C27.1 51.23,22.65 IC3.1 51.25,22.2 | 51.25,22.2 R27.1 49.05,23.17 v49.05,24.77 | 51.25,22.2 51.25,22.89 | R30.1 86.05,14.12 IC6.1 84.26,15.85 C30.1 83.98,11.75 84.61,11.11 84.61,7.3 83.98,6.67 81.44,6.67 80.8,7.3 J7.1 80.8,10.48 81.44,11.11 81.44,17.14 79.22,19.37 76.99,19.37 75.41,20.95 75.41,26.99 76.14,27.72 R29.1 | C31.1 79.17,27.73 IC5.1 79.19,27.27 | R29.1 79.19,27.27 | 79.19,27.27 79.19,27.97 | 77.3,27.94 R29.1
  Bottom 0.61: J3.1 26.66,6.19 | 26.66,6.19 27.3,6.82 v29.84,6.82 | 26.66,6.19 25.71,7.14 22.85,7.14 21.58,8.41 21.58,11.9 22.85,13.17 v22.85,24.29 | J5.1 52.86,6.67 | 52.86,6.67 53.5,7.3 v56.04,7.3 | 52.86,6.67 51.91,7.62 49.05,7.62 47.78,8.89 47.78,12.38 49.05,13.65 v49.05,24.77
+5POWER
  Top 0.406: X14.2 49.74,92.87
  Top 0.813: X8.2 24.13,85.88 24.76,85.25 50.16,85.25 50.8,85.88 64.77,85.88 65.4,85.25 X4.2 | X13.2 X10.2 X14.2
  Bottom 0.406: R12.2 65.4,77.63 | R4.2 64.98,83.76 X4.2 | R6.2 60.11,92.45 X10.2 | R8.2 71.54,92.45 X13.2 | R14.2 48.04,92.45 X14.2
  Bottom 0.813: X5.2 65.4,69.37 | 65.4,69.37 X7.2 65.4,77.63 | X13.2 74.93,92.87 76.2,91.6 76.2,89.69 74.29,87.79 67.94,87.79 66.67,86.52 | 66.67,86.52 65.4,85.25 X4.2 65.4,78.05 R12.2 C5.2 | C4.2 66.67,86.52 | C7.2 65.4,69.37 | 65.4,69.37 R16.2 | C8.2 R14.2 | C9.2 R6.2 | C11.2 R8.2
+5VCC  (via drill 0.8)
  Top 0.813: U$2.P1_2 U$2.P1_4 3.18,95.41 1.9,94.14 1.9,82.71 4.44,80.17 X3.2 8.25,80.8 10.16,82.71 v21.59,82.71 | X11.2 X6.2 X9.2 | v54.61,88.42 29.84,88.42 27.94,90.33 22.86,90.33 21.59,89.06 X8.3
  Bottom 0.406: X6.2 54.19,75.51 R10.2 C2.2 | X9.2 54.61,68.95 R18.2 C3.2 | R2.2 C1.2 54.61,85.49
  Bottom 0.813: v21.59,82.71 X8.3 | v54.61,88.42 54.61,85.49 X11.2
+7VCC
  Top 0.813: 70.48,73.82 70.48,85.25 68.58,87.15 27.3,87.15 X8.1 | 70.48,73.82 70.48,66.83 | 70.48,66.83 70.48,62.39 69.85,61.75 64.77,61.75 63.5,60.48 63.5,49.05 60.32,45.88 52.7,45.88 51.43,47.15 | 51.43,47.15 U$3.P$9 | U$4.P$9 34.29,47.15 35.56,45.88 50.16,45.88 51.43,47.15 | C6.+ 70.61,66.32 70.48,66.83 | C10.+ 70.61,73.94 70.48,73.82
A  (2 unrouted)
  Top 0.61: R22.2 24.56,19.88 IC1.2 24.31,19.49 C16.1 23.81,17.72 23.81,16.35 24.76,15.39 25.39,15.39 28.25,12.54 28.25,5.55 29.2,4.6 J3.2 | R27.2 50.76,20.36 IC3.2 50.51,19.97 C24.1 50.01,18.2 50.01,16.83 50.96,15.88 51.59,15.88 54.45,13.02 54.45,6.03 55.4,5.08 J5.2 | R29.2 78.7,25.44 IC5.2 78.45,25.05 C28.1 77.95,23.28 77.95,21.91 78.9,20.95 79.53,20.95 82.39,18.1 82.39,11.11 83.34,10.16 J7.2
B  (2 unrouted)
  Top 0.61: C17.1 35.9,10.29 IC2.2 34.11,8.56 R23.2 33.97,6.82 31.74,4.6 J3.3 | C25.1 62.1,10.77 IC4.2 60.31,9.04 R28.2 60.17,7.3 57.94,5.08 J5.3 | C29.1 90.04,15.85 IC6.2 88.25,14.12 R30.2 88.11,12.38 85.88,10.16 J7.3
CDEA3.3
  Bottom 0.406: CODER-D-EXT.3 21.59,56.04 24.13,58.58 24.13,60.48 26.03,62.39 29.21,62.39 U$1.6
CDEB3.3
  Bottom 0.406: CODER-D-EXT.2 21.59,58.58 22.86,59.85 22.86,61.12 25.4,63.66 27.94,63.66 U$1.5
CGEA3.3
  Top 0.406: CODER-G-EXT.3 10.79,56.04 8.25,58.58 8.25,64.93 11.43,68.1 24.76,68.1 26.67,66.2 U$1.4
CGEB3.3
  Top 0.406: CODER-G-EXT.2 10.79,58.58 9.52,59.85 9.52,64.29 12.06,66.83 23.49,66.83 24.13,66.2 U$1.3
GND  (via drill 0.6 pad 0.61, 0.8 pad 0.61, 1 pad 2.54)  (6 unrouted)
  Top 0.406: 41.91,56.67 42.54,56.04 | U$6.P$13 5.25,13.81 U$5.P$13 U$5.P$4 | 43.65,61.75 48.51,61.75 48.51,61.69 | U$8.P$13 5.41,31.75 U$7.P$13 U$7.P$4
  Bottom 0.813: X10.3 61.83,95.41 C9.1
  other vias: 62.87,43.34 59.05,64.93 26.67,57.31 50.16,57.31 24.13,73.18 29.21,73.18 34.29,73.18 6.98,55.4 9.52,10 9.68,27.94
  pour Bottom: -3.17,98.58 -2.65,42.26 98.31,41.78 88.27,98.58
  pour Top: -3.81,99.22 -4.45,99.22 -0.48,42 96.12,41.6 97.49,44.41 91.44,99.85 0,100.49 0,99.85
  pour Top (isolate 0.61): 1.27,18.25 1.27,1.75 17.78,1.75 17.78,18.25
  pour Bottom: 1.27,18.25 1.27,1.75 17.78,1.75 17.78,18.25
  pour Top (isolate 0.61): 20.95,30 20.95,0.79 45.08,0.79 45.08,30
  pour Bottom: 20.95,30 20.95,0.79 45.08,0.79 45.08,30
  pour Top (isolate 0.61): 1.43,36.2 1.43,19.68 17.94,19.68 17.94,36.2
  pour Bottom: 1.43,36.2 1.43,19.68 17.94,19.68 17.94,36.2
  pour Top (isolate 0.61): 47.15,30.48 47.15,1.27 71.28,1.27 71.28,30.48
  pour Bottom: 47.15,30.48 47.15,1.27 71.28,1.27 71.28,30.48
  pour Top (isolate 0.61): 72.55,36.83 72.55,3.49 98.58,3.49 98.58,36.83
I2C-SCL
  Top 0.406: X12.1 8.89,85.88 9.53,85.25 10.16,85.25 22.86,85.25 24.13,83.98 31.11,83.98 31.75,83.34 U$1.19/A5 | X12.1
  Bottom 0.406: X12.1 U$2.P1_5 | U$2.P1_5
I2C-SDA
  Top 0.406: 6.35,85.88 | 6.35,85.88 8.25,83.98 22.22,83.98 23.49,82.71 29.21,82.71 30.48,81.44 30.48,79.53 31.11,78.9 33.65,78.9 34.29,79.53 U$1.18/A4 | 6.35,85.88 X12.2
  Bottom 0.406: U$2.P1_3 X12.2 | X12.2
MOTOR-D-1
  Bottom 0.813: X2.1 26.67,49.69 30.48,53.5 U$4.P$7
MOTOR-D-2
  Bottom 0.813: X2.2 26.67,47.15 28.57,49.05 29.84,49.05 32.38,46.51 34.92,46.51 U$4.P$10
MOTOR-D-BRAKE
  Top 0.406: J2.3 36.83,56.04 U$4.P$2
  Bottom 0.406: U$1.8 U$4.P$2
MOTOR-D-DIR
  Top 0.406: J2.4 34.29,54.98 U$4.P$3
  Bottom 0.406: U$1.7 U$4.P$3
MOTOR-D-PWM
  Top 0.406: U$1.9 39.37,64.29 38.1,63.02 33.02,63.02 29.84,59.85 29.84,57.94 U$4.P$6 34.51,53.28 J2.5
MOTOR-D-SENSE  (via drill 0.6 pad 0.61)
  Top 0.406: v29.84,66.83 30.48,66.2 30.48,62.39 29.21,61.12 29.21,53.5 U$4.P$8
  Bottom 0.406: v29.84,66.83 24.76,66.83 21.59,70.01 U$1.23/A9 | U$4.P$8 32.38,51.59 32.38,52.23 37.46,57.31 39.37,57.31 39.9,56.78 J2.2
MOTOR-G-1  (via drill 0.8 pad 0.61)
  Top 0.813: X1.1 16.51,49.69 18.41,51.59 27.3,51.59 v34.29,44.61
  Bottom 0.813: v34.29,44.61 41.91,44.61 46.99,49.69 46.99,52.86 47.62,53.5 U$3.P$7
MOTOR-G-2
  Bottom 0.813: X1.2 13.33,47.15 17.78,42.7 50.16,42.7 53.97,46.51 U$3.P$10
MOTOR-G-BRAKE
  Top 0.406: U$3.P$2 53.97,56.04 J1.3
  Bottom 0.406: U$1.12 48.89,63.02 52.07,63.02 U$3.P$2
MOTOR-G-DIR
  Top 0.406: U$3.P$3 51.43,61.33 J1.4
  Bottom 0.406: U$1.11 44.45,64.29 47.62,61.12 U$3.P$3
MOTOR-G-PWM
  Top 0.406: J1.5 51.65,53.28 U$3.P$6
  Bottom 0.406: U$1.10 47.62,59.85 47.62,56.67 48.26,56.04 U$3.P$6
MOTOR-G-SENSE  (via drill 0.6 pad 0.61)
  Top 0.406: v46.35,59.21 46.35,52.23 47.62,50.96 U$3.P$8
  Bottom 0.406: v46.35,59.21 42.54,63.02 41.27,63.02 40.64,63.66 40.64,65.56 40,66.2 32.38,66.2 30.48,68.1 25.4,68.1 22.86,70.64 22.86,78.9 U$1.22/A8 | U$3.P$8 48.89,51.59 54.61,57.31 56.3,57.31 J1.2
N$3
  Top 0.813: X3.1 12.7,77.63 13.97,78.9 U$1.VIN
N$12
  Top 0.406: R19.1 14.64,4.95 U$6.P$5
N$17
  Top 0.406: 8.51,3.65 U$6.P$1 5.98,5.93 LED1.A
N$18
  Top 0.406: U$6.P$2 11.56,4.41 11.56,5.67 U$5.P$2
N$20
  Top 0.406: U$6.P$3 13.33,4.81 U$5.P$3
N$21
  Top 0.406: U$6.P$6 15.87,8.48 14.6,7.21 13.7,7.21 U$5.P$6
N$22
  Top 0.406: U$6.P$7 15.87,11.02 14.6,9.75 14.6,8.73 14.1,8.22 13.6,8.22 U$5.P$7
N$23
  Top 0.406: U$6.P$8 13.29,11.22 U$5.P$8
  Bottom 0.406: U$6.P$8 14.39,13.81 R20.2
N$24
  Top 0.406: U$5.P$15 5.45,11.78 4.95,11.78 4.6,11.43 4.6,10.16 U$6.P$15
  Bottom 0.406: C13.1 5.71,11.27 U$6.P$15
N$25
  Top 0.406: U$5.P$14 5.6,12.54 4.44,12.54 U$6.P$14
  Bottom 0.406: C15.1 4.76,12.86 U$6.P$14
N$26
  Top 0.406: U$5.P$12 5.71,14.27 U$6.P$12
  Bottom 0.406: C12.1 6.13,15.93 U$6.P$12
N$27
  Top 0.406: U$5.P$11 6.98,13.92 6.98,15.08 U$6.P$11
  Bottom 0.406: C12.2 7.83,15.93 U$6.P$11
N$28
  Top 0.406: U$5.P$10 7.75,14.08 7.75,14.57 8.09,14.92 9.11,14.92 10.54,16.35 U$6.P$10
N$29
  Top 0.406: U$5.P$9 9.78,14.57 11.56,14.57 U$6.P$9
  Bottom 0.406: C15.2 8.07,12.86 9.78,14.57 11.56,14.57 U$6.P$9 11.33,14.34 C14.1
N$30
  Top 0.406: R19.2 13.37,6.62 U$5.P$5
N$31
  Top 0.406: U$5.P$1 10.07,5.57 R21.2
N$32
  Top 0.406: LED1.K 7.25,6.66 R21.1
N$36
  Bottom 1.422: H2.1 H1.1 40.63,9.17 J4.2
N$37
  Bottom 1.422: H3.1 | J4.1 38.09,6.19 34.28,10 24.57,10 H3.1 | H4.1 H3.1
N$41
  Top 0.406: R24.1 14.8,22.89 U$8.P$5
N$42
  Top 0.406: 8.67,21.59 U$8.P$1 6.14,23.87 LED2.A
N$43
  Top 0.406: U$8.P$2 11.72,22.35 11.72,23.61 U$7.P$2
N$44
  Top 0.406: U$8.P$3 13.49,22.75 U$7.P$3
N$45
  Top 0.406: U$8.P$6 16.03,26.42 14.76,25.15 13.86,25.15 U$7.P$6
N$46
  Top 0.406: U$8.P$7 16.03,28.96 14.76,27.69 14.76,26.67 14.26,26.16 13.76,26.16 U$7.P$7
N$47
  Top 0.406: U$8.P$8 13.45,29.16 U$7.P$8
  Bottom 0.406: U$8.P$8 14.55,31.75 R25.2
N$48
  Top 0.406: U$7.P$15 5.61,29.72 5.11,29.72 4.76,29.37 4.76,28.1 U$8.P$15
  Bottom 0.406: C21.1 5.87,29.21 U$8.P$15
N$49
  Top 0.406: U$7.P$14 5.76,30.48 4.6,30.48 U$8.P$14
  Bottom 0.406: C23.1 4.92,30.8 U$8.P$14
N$50
  Top 0.406: U$7.P$12 5.87,32.21 U$8.P$12
  Bottom 0.406: C20.1 6.29,33.87 U$8.P$12
N$51
  Top 0.406: U$7.P$11 7.14,31.86 7.14,33.02 U$8.P$11
  Bottom 0.406: C20.2 7.99,33.87 U$8.P$11
N$52
  Top 0.406: U$7.P$10 7.91,32.02 7.91,32.51 8.25,32.86 9.27,32.86 10.7,34.29 U$8.P$10
N$53
  Top 0.406: U$7.P$9 9.94,32.51 11.72,32.51 U$8.P$9
  Bottom 0.406: C23.2 8.23,30.8 9.94,32.51 11.72,32.51 U$8.P$9 11.49,32.28 C22.1
N$54
  Top 0.406: R24.2 13.53,24.56 U$7.P$5
N$55
  Top 0.406: U$7.P$1 10.23,23.51 R26.2
N$56
  Top 0.406: LED2.K 7.41,24.6 R26.1
N$60
  Bottom 1.422: H6.1 H5.1 66.83,9.65 J6.2
N$61
  Bottom 1.422: H7.1 | J6.1 64.29,6.67 60.48,10.48 50.77,10.48 H7.1 | H8.1 H7.1
N$65
  Top 1.27: J8.2 94.77,14.73 PAD2.1 PAD4.1
N$66
  Top 1.27: PAD1.1 77.87,32.63 74.14,28.89 74.14,20.13 PAD3.1 78.64,6.92 80.49,5.08 90.96,5.08 92.23,6.35 J8.1
RXTEENSY
  Bottom 0.406: U$1.0 16.51,71.28 17.78,72.55 17.78,82.07 12.7,87.15 12.7,94.14 U$2.P1_8
SRV1
  Bottom 0.406: X11.1 52.49,83.76 R2.1 52.02,86.35 Q1.3
SRV2
  Bottom 0.406: X4.1 63.28,83.76 R4.1 63.28,86.52 60.96,88.42 58.42,88.42 57.15,89.69 53.97,89.69 52.07,87.79 41.91,87.79 40.64,86.52 Q2.3 40.64,87.15
SRV3  (via drill 0.6)
  Top 0.406: X6.1 52.07,72.55 50.8,71.28 45.08,71.28 v43.18,73.18
  Bottom 0.406: R10.1 52.49,75.51 X6.1 | Q3.3 43.01,73.35 v43.18,73.18
SRV4
  Bottom 0.406: R12.1 63.28,75.51 X7.1 62.86,72.55 61.59,71.28 38.73,71.28 36.83,73.18 Q4.3
SRV5
  Bottom 0.406: X5.1 63.28,67.25 R16.1 63.28,69.59 62.23,70.64 51.43,70.64 49.53,68.74 33.65,68.74 31.75,70.64 Q5.3
SRV6
  Bottom 0.406: R18.1 52.49,67.25 X9.1 51.43,66.2 45.08,66.2 43.81,67.47 33.02,67.47 31.11,69.37 29.21,69.37 26.67,71.91 Q6.3
SRV8
  Bottom 0.406: Q7.3 31.11,85.88 34.29,82.07 36.19,82.07 38.73,85.25 38.73,87.79 39.37,88.42 51.43,88.42 53.34,90.33 X10.1 60.11,90.75 R6.1
SRV9
  Bottom 0.406: Q8.3 37,86.69 38.1,87.79 38.1,88.42 38.73,89.06 50.8,89.06 52.07,90.33 52.07,94.77 53.97,96.68 63.5,96.68 64.13,96.04 64.13,90.96 64.77,90.33 X13.1 71.54,90.75 R8.1
SRV10
  Bottom 0.406: Q9.3 39.37,91.6 40.64,90.33 X14.1 48.04,90.75 R14.1
SRV13.3
  Bottom 0.406: U$1.14/A0 44.45,82.29 R1.1 44.77,83.44 Q1.2
SRV23.3
  Bottom 0.406: U$1.15/A1 39.79,82.29 R3.1 39.69,83.44 Q2.2
SRV33.3
  Bottom 0.406: U$1.16/A2 39.37,79.53 40.64,78.26 41.91,78.26 42.54,77.63 42.54,77.21 R9.1 42.76,75.65 Q3.2
SRV43.3
  Bottom 0.406: Q4.2 37.78,76.89 R11.1 37.68,78.05 36.83,78.9 U$1.17/A3
SRV53.3
  Bottom 0.406: Q5.2 32.6,75.65 R15.1 32.38,77.21 32.38,77.63 31.75,78.26 30.48,78.26 29.21,79.53 U$1.20/A6
SRV63.3
  Bottom 0.406: U$1.21/A7 26.67,78.9 27.3,78.26 27.3,77.21 R17.1 27.62,76.89 Q6.2
SRV83.3
  Bottom 0.406: U$2.P1_19 26.67,91.6 27.3,90.96 31.11,90.96 31.75,90.33 31.75,89.91 R5.1 31.96,88.35 Q7.2
SRV93.3
  Bottom 0.406: Q8.2 37.04,88.35 R7.1 36.83,89.91 36.83,90.96 36.19,91.6 29.84,91.6 29.21,92.23 U$2.P1_21
SRV103.3
  Bottom 0.406: Q9.2 40.22,94.7 R13.1 40,96.26 40,96.68 39.37,97.31 36.19,97.31 U$2.P1_26
TXTEENSY
  Bottom 0.406: U$1.1 19.05,70.64 20.32,71.91 20.32,81.44 15.24,86.52 15.24,94.14 U$2.P1_10

### Text on the board
Top: GobGob 2013
_tNames: C4 | C4 | IC1 | IC1 | R1 | R1 | C4 | C1 | C1 | IC1 | R1 | IC2 | C4 | IC2 | C4 | C1 | IC1 | IC1 | C3 | R2 | C2 | R1 | C3 | R2 | C2 | IC2 | R1 | C1 | C1 | C3 | R2 | C2 | IC2 | IC2 | JP1 | JP1 | C3 | R2 | C2 | C3 | R2 | C2 | JP1 | JP1 | JP1